# EAGLE schematic dummy (EAGLE 9.6.2)
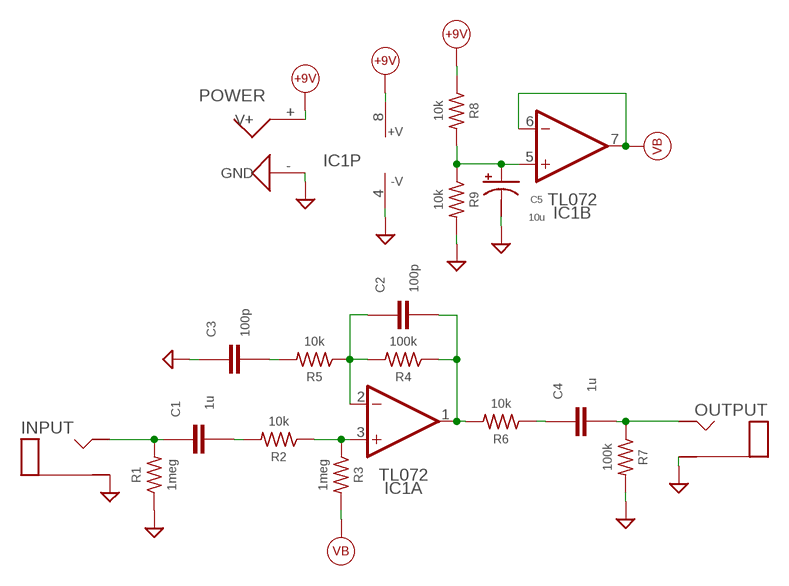
[diagram p0: schematic, sheet 1]

## Parts
C1  1u  CAPSMD  [0805]
C2  100p  CAPSMD  [0805]
C3  100p  CAPSMD  [0805]
C4  1u  CAPSMD  [0805]
C5  10u  ELECTROLYTIC  [4X4.5SMD]
IC1  TL072  DUAL_OPAMPSMD  [SO08]
INPUT  generic  MONO  [TWO_PADS]
OUTPUT  generic  MONO  [TWO_PADS]
POWER  POWERJACK_PADS  [AB9V]
R1  1meg  RESISTOR0805  [0805]
R2  10k  RESISTOR0805  [0805]
R3  1meg  RESISTOR0805  [0805]
R4  100k  RESISTOR0805  [0805]
R5  10k  RESISTOR0805  [0805]
R6  10k  RESISTOR0805  [0805]
R7  100k  RESISTOR0805  [0805]
R8  10k  RESISTOR0805  [0805]
R9  10k  RESISTOR0805  [0805]

## Nets
+9V: IC1.8(P:VDD) POWER.+(V+) R8.1
+VB: IC1.6(B:-IN) IC1.7(B:OUT) R3.2
GND: C3.1 C5.P$2(-) IC1.4(P:VSS) INPUT.S(SLEEVE) OUTPUT.S(SLEEVE) POWER.-(GND) R1.1 R7.2 R9.2
N$1: C1.1 INPUT.T(TIP) R1.2
N$2: C1.2 R2.2
N$3: IC1.3(A:+IN) R2.1 R3.1
N$4: C2.2 IC1.1(A:OUT) R4.1 R6.2
N$5: C2.1 IC1.2(A:-IN) R4.2 R5.1
N$6: C3.2 R5.2
N$8: C4.1 R6.1
N$9: C4.2 OUTPUT.T(TIP) R7.1
N$10: C5.P$1(+) IC1.5(B:+IN) R8.2 R9.1

## Library data of the parts
C1-C4 = Capacitors:CAP
C5 = Capacitors:ELECTROLYTIC
IC1 = OpAmps:DUAL_OPAMP
INPUT OUTPUT = jacks:MONO: Mono 1/4" Phone Jack
POWER = PowerConnectors:POWERJACK_PADS
R1-R9 = Resistors:RESISTOR